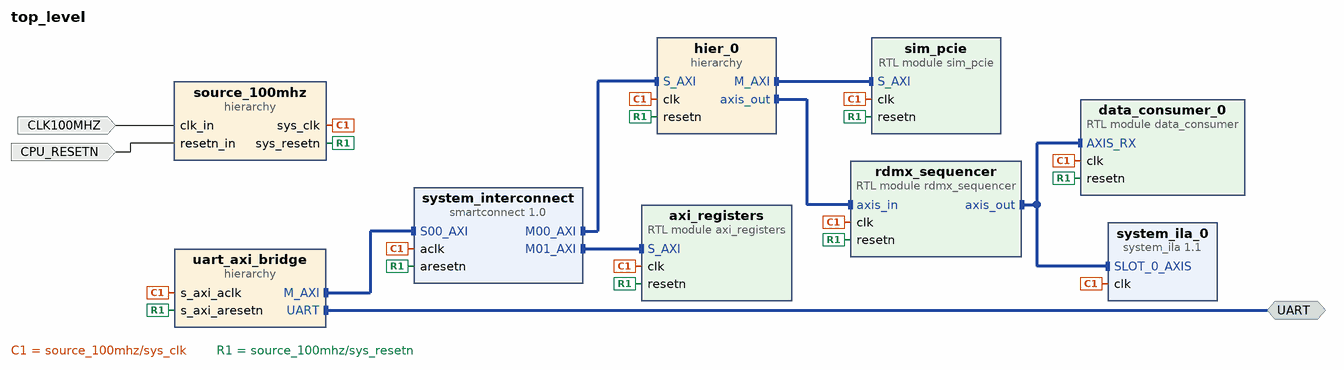
[diagram p0: block diagram of the top level]
# Vivado block design top_level, xc7a100tcsg324-1, Vivado 2024.2
create_bd_design top_level

create_bd_intf_port -mode Master -vlnv xilinx.com:interface:uart_rtl:1.0 UART
create_bd_port -dir I -type clk CLK100MHZ
create_bd_port -dir I -type rst CPU_RESETN

create_bd_cell -type hier source_100mhz
create_bd_cell -type hier uart_axi_bridge
create_bd_cell -type ip -vlnv xilinx.com:ip:smartconnect:1.0 system_interconnect
set_property -dict {CONFIG.NUM_MI 2 CONFIG.NUM_SI 1} [get_bd_cells system_interconnect]
create_bd_cell -type module -reference sim_pcie sim_pcie
set_property -dict {CONFIG.DW 64} [get_bd_cells sim_pcie]
create_bd_cell -type module -reference data_consumer data_consumer_0
set_property -dict {CONFIG.DW 512 CONFIG.NREADY_CYCLES 0 CONFIG.READY_CYCLES 0} [get_bd_cells data_consumer_0]
create_bd_cell -type module -reference rdmx_sequencer rdmx_sequencer
create_bd_cell -type hier hier_0
create_bd_cell -type ip -vlnv xilinx.com:ip:system_ila:1.1 system_ila_0
set_property -dict [list \
  CONFIG.C_DATA_DEPTH 2048 \
  CONFIG.C_SLOT_0_INTF_TYPE xilinx.com:interface:axis_rtl:1.0 \
] [get_bd_cells system_ila_0]
create_bd_cell -type module -reference axi_registers axi_registers

# ---- hierarchy /source_100mhz ----
current_bd_instance /source_100mhz
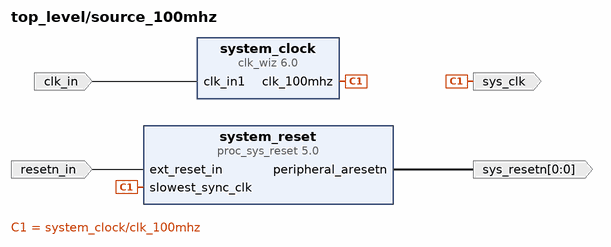
[diagram p1: block diagram inside /source_100mhz]
create_bd_pin -dir I -type clk clk_in
create_bd_pin -dir I -type rst resetn_in
create_bd_pin -dir O -type clk sys_clk
create_bd_pin -dir O -from 0 -to 0 sys_resetn

create_bd_cell -type ip -vlnv xilinx.com:ip:clk_wiz:6.0 system_clock
set_property -dict [list \
  CONFIG.CLKOUT1_JITTER 151.636 \
  CONFIG.CLKOUT1_REQUESTED_OUT_FREQ 50 \
  CONFIG.CLK_OUT1_PORT clk_100mhz \
  CONFIG.MMCM_CLKOUT0_DIVIDE_F 20.000 \
  CONFIG.USE_LOCKED false \
  CONFIG.USE_RESET false \
] [get_bd_cells system_clock]
create_bd_cell -type ip -vlnv xilinx.com:ip:proc_sys_reset:5.0 system_reset

# ---- hierarchy /uart_axi_bridge ----
current_bd_instance /uart_axi_bridge
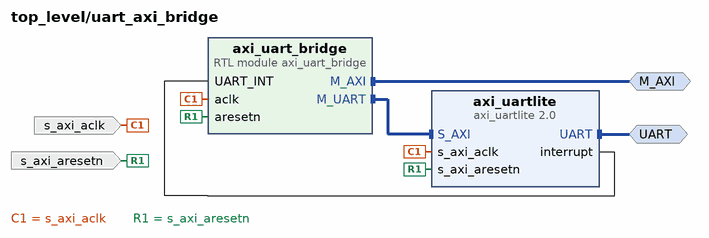
[diagram p2: block diagram inside /uart_axi_bridge]
create_bd_intf_pin -mode Master -vlnv xilinx.com:interface:uart_rtl:1.0 UART
create_bd_intf_pin -mode Master -vlnv xilinx.com:interface:aximm_rtl:1.0 M_AXI
create_bd_pin -dir I -type clk s_axi_aclk
create_bd_pin -dir I -type rst s_axi_aresetn

create_bd_cell -type module -reference axi_uart_bridge axi_uart_bridge
create_bd_cell -type ip -vlnv xilinx.com:ip:axi_uartlite:2.0 axi_uartlite
set_property -dict {CONFIG.C_BAUDRATE 115200} [get_bd_cells axi_uartlite]

# ---- hierarchy /hier_0 ----
current_bd_instance /hier_0
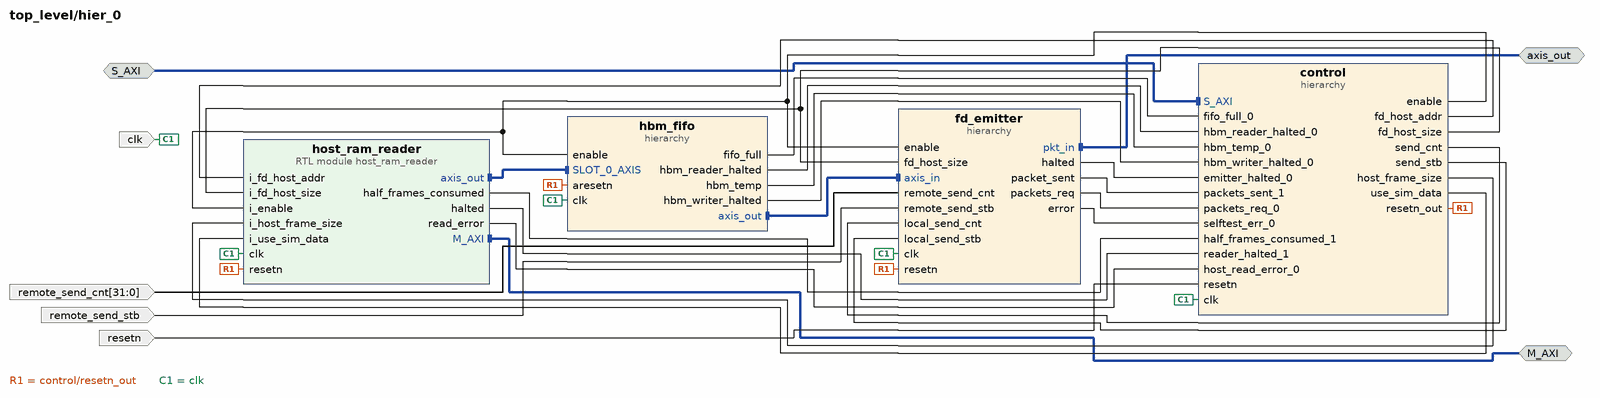
[diagram p3: block diagram inside /hier_0]
create_bd_intf_pin -mode Master -vlnv xilinx.com:interface:aximm_rtl:1.0 M_AXI
create_bd_intf_pin -mode Master -vlnv xilinx.com:interface:axis_rtl:1.0 axis_out
create_bd_intf_pin -mode Slave -vlnv xilinx.com:interface:aximm_rtl:1.0 S_AXI
create_bd_pin -dir I -type clk clk
create_bd_pin -dir I -type rst resetn
create_bd_pin -dir I remote_send_stb
create_bd_pin -dir I -from 31 -to 0 remote_send_cnt

create_bd_cell -type module -reference host_ram_reader host_ram_reader
set_property -dict {CONFIG.DW 64} [get_bd_cells host_ram_reader]
create_bd_cell -type hier control
create_bd_cell -type hier hbm_fifo
create_bd_cell -type hier fd_emitter

# ---- hierarchy /hier_0/control ----
current_bd_instance /hier_0/control
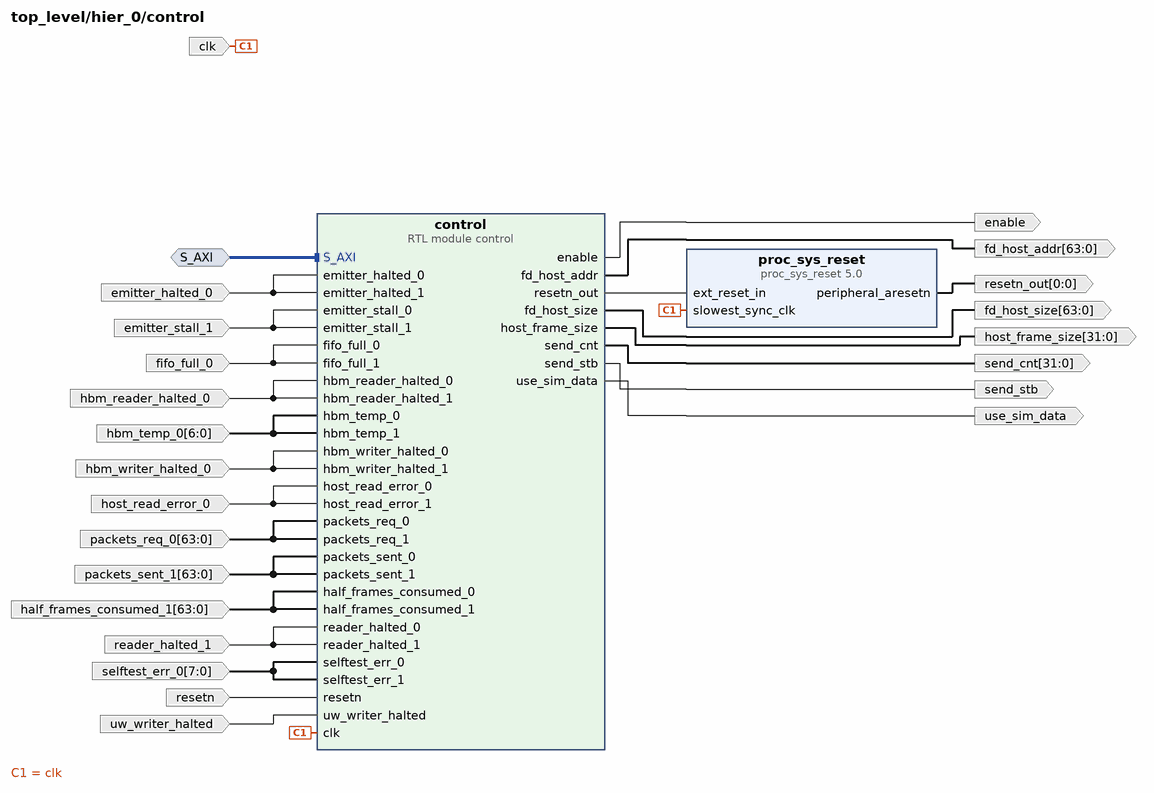
[diagram p4: block diagram inside /hier_0/control]
create_bd_intf_pin -mode Slave -vlnv xilinx.com:interface:aximm_rtl:1.0 S_AXI
create_bd_pin -dir I -type clk clk
create_bd_pin -dir I -type rst resetn
create_bd_pin -dir O enable
create_bd_pin -dir O -from 31 -to 0 host_frame_size
create_bd_pin -dir O -from 63 -to 0 fd_host_addr
create_bd_pin -dir O -from 63 -to 0 fd_host_size
create_bd_pin -dir I -from 63 -to 0 half_frames_consumed_1
create_bd_pin -dir I reader_halted_1
create_bd_pin -dir O send_stb
create_bd_pin -dir O -from 31 -to 0 send_cnt
create_bd_pin -dir O use_sim_data
create_bd_pin -dir O -from 0 -to 0 -type rst resetn_out
create_bd_pin -dir I -from 6 -to 0 hbm_temp_0
create_bd_pin -dir I -from 7 -to 0 selftest_err_0
create_bd_pin -dir I fifo_full_0
create_bd_pin -dir I emitter_halted_0
create_bd_pin -dir I -from 63 -to 0 packets_req_0
create_bd_pin -dir I -from 63 -to 0 packets_sent_1
create_bd_pin -dir I host_read_error_0
create_bd_pin -dir I uw_writer_halted
create_bd_pin -dir I hbm_writer_halted_0
create_bd_pin -dir I hbm_reader_halted_0
create_bd_pin -dir I emitter_stall_1

create_bd_cell -type module -reference control control
create_bd_cell -type ip -vlnv xilinx.com:ip:proc_sys_reset:5.0 proc_sys_reset

# ---- hierarchy /hier_0/hbm_fifo ----
current_bd_instance /hier_0/hbm_fifo
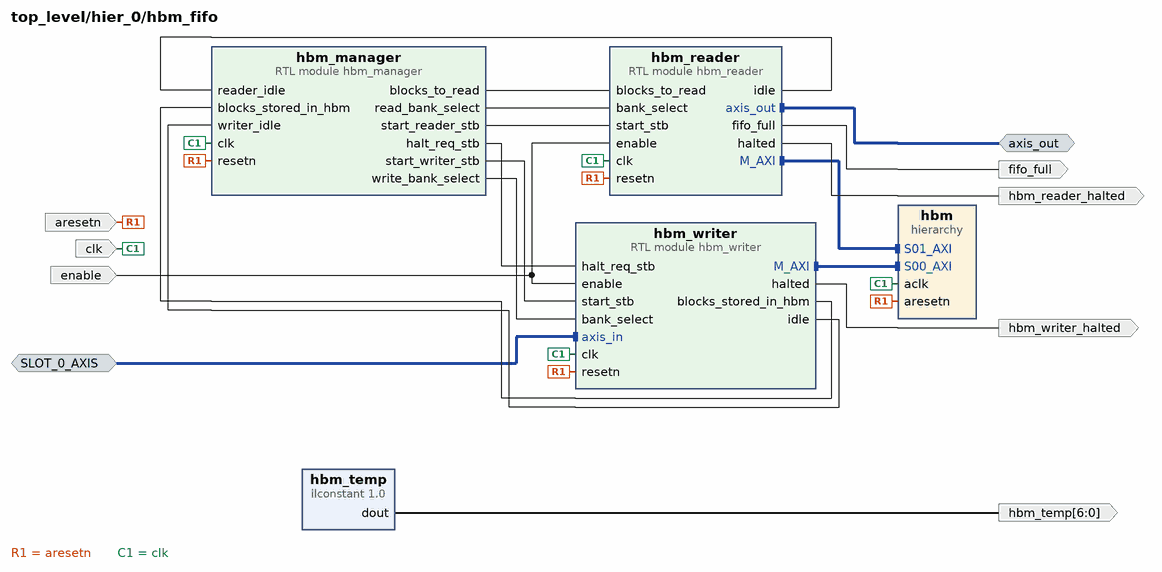
[diagram p5: block diagram inside /hier_0/hbm_fifo]
create_bd_intf_pin -mode Slave -vlnv xilinx.com:interface:axis_rtl:1.0 SLOT_0_AXIS
create_bd_intf_pin -mode Master -vlnv xilinx.com:interface:axis_rtl:1.0 axis_out
create_bd_pin -dir I -type clk clk
create_bd_pin -dir I aresetn
create_bd_pin -dir O -from 6 -to 0 hbm_temp
create_bd_pin -dir O fifo_full
create_bd_pin -dir I enable
create_bd_pin -dir O hbm_writer_halted
create_bd_pin -dir O hbm_reader_halted

create_bd_cell -type module -reference hbm_writer hbm_writer
set_property -dict {CONFIG.DW 64} [get_bd_cells hbm_writer]
create_bd_cell -type hier hbm
create_bd_cell -type module -reference hbm_manager hbm_manager
create_bd_cell -type module -reference hbm_reader hbm_reader
set_property -dict {CONFIG.DW 64} [get_bd_cells hbm_reader]
create_bd_cell -type inline_hdl -vlnv xilinx.com:inline_hdl:ilconstant:1.0 hbm_temp
set_property -dict {CONFIG.CONST_VAL 125 CONFIG.CONST_WIDTH 7} [get_bd_cells hbm_temp]

# ---- hierarchy /hier_0/hbm_fifo/hbm ----
current_bd_instance /hier_0/hbm_fifo/hbm
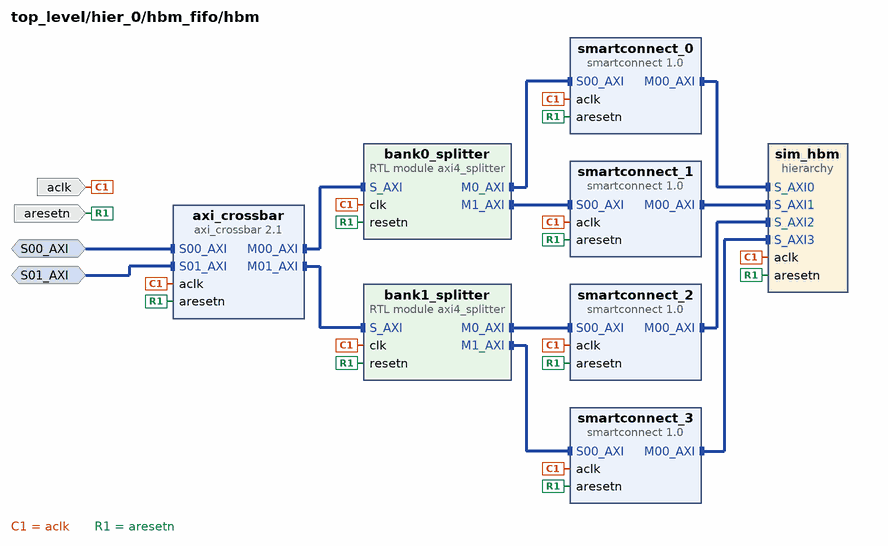
[diagram p6: block diagram inside /hier_0/hbm_fifo/hbm]
create_bd_intf_pin -mode Slave -vlnv xilinx.com:interface:aximm_rtl:1.0 S00_AXI
create_bd_intf_pin -mode Slave -vlnv xilinx.com:interface:aximm_rtl:1.0 S01_AXI
create_bd_pin -dir I aclk
create_bd_pin -dir I aresetn

create_bd_cell -type ip -vlnv xilinx.com:ip:smartconnect:1.0 smartconnect_0
set_property -dict {CONFIG.NUM_MI 1 CONFIG.NUM_SI 1} [get_bd_cells smartconnect_0]
create_bd_cell -type ip -vlnv xilinx.com:ip:smartconnect:1.0 smartconnect_1
set_property -dict {CONFIG.NUM_MI 1 CONFIG.NUM_SI 1} [get_bd_cells smartconnect_1]
create_bd_cell -type ip -vlnv xilinx.com:ip:smartconnect:1.0 smartconnect_2
set_property -dict {CONFIG.NUM_MI 1 CONFIG.NUM_SI 1} [get_bd_cells smartconnect_2]
create_bd_cell -type ip -vlnv xilinx.com:ip:smartconnect:1.0 smartconnect_3
set_property -dict {CONFIG.NUM_MI 1 CONFIG.NUM_SI 1} [get_bd_cells smartconnect_3]
create_bd_cell -type module -reference axi4_splitter bank0_splitter
set_property -dict {CONFIG.BASE_ADDR1 0x0000000000001000 CONFIG.DW 64} [get_bd_cells bank0_splitter]
create_bd_cell -type module -reference axi4_splitter bank1_splitter
set_property -dict [list \
  CONFIG.ADDR_OFFSET 0x0000000000002000 \
  CONFIG.BASE_ADDR0 0x0000000000002000 \
  CONFIG.BASE_ADDR1 0x0000000000003000 \
  CONFIG.DW 64 \
] [get_bd_cells bank1_splitter]
create_bd_cell -type ip -vlnv xilinx.com:ip:axi_crossbar:2.1 axi_crossbar
set_property -dict {CONFIG.NUM_MI 2 CONFIG.NUM_SI 2 CONFIG.STRATEGY 2} [get_bd_cells axi_crossbar]
create_bd_cell -type hier sim_hbm

# ---- hierarchy /hier_0/hbm_fifo/hbm/sim_hbm ----
current_bd_instance /hier_0/hbm_fifo/hbm/sim_hbm
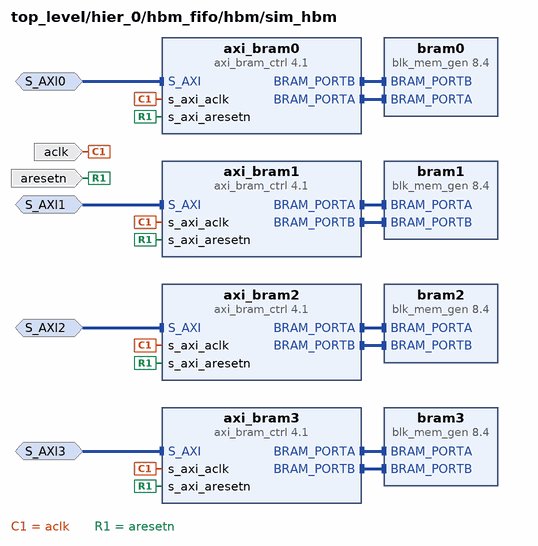
[diagram p7: block diagram inside /hier_0/hbm_fifo/hbm/sim_hbm]
create_bd_intf_pin -mode Slave -vlnv xilinx.com:interface:aximm_rtl:1.0 S_AXI0
create_bd_intf_pin -mode Slave -vlnv xilinx.com:interface:aximm_rtl:1.0 S_AXI1
create_bd_intf_pin -mode Slave -vlnv xilinx.com:interface:aximm_rtl:1.0 S_AXI2
create_bd_intf_pin -mode Slave -vlnv xilinx.com:interface:aximm_rtl:1.0 S_AXI3
create_bd_pin -dir I aclk
create_bd_pin -dir I aresetn

create_bd_cell -type ip -vlnv xilinx.com:ip:blk_mem_gen:8.4 bram3
set_property -dict {CONFIG.Memory_Type True_Dual_Port_RAM} [get_bd_cells bram3]
create_bd_cell -type ip -vlnv xilinx.com:ip:axi_bram_ctrl:4.1 axi_bram0
set_property -dict {CONFIG.DATA_WIDTH 32 CONFIG.SINGLE_PORT_BRAM 0} [get_bd_cells axi_bram0]
create_bd_cell -type ip -vlnv xilinx.com:ip:axi_bram_ctrl:4.1 axi_bram1
set_property -dict {CONFIG.DATA_WIDTH 32 CONFIG.SINGLE_PORT_BRAM 0} [get_bd_cells axi_bram1]
create_bd_cell -type ip -vlnv xilinx.com:ip:axi_bram_ctrl:4.1 axi_bram2
set_property -dict {CONFIG.DATA_WIDTH 32 CONFIG.SINGLE_PORT_BRAM 0} [get_bd_cells axi_bram2]
create_bd_cell -type ip -vlnv xilinx.com:ip:axi_bram_ctrl:4.1 axi_bram3
set_property -dict {CONFIG.DATA_WIDTH 32 CONFIG.SINGLE_PORT_BRAM 0} [get_bd_cells axi_bram3]
create_bd_cell -type ip -vlnv xilinx.com:ip:blk_mem_gen:8.4 bram1
set_property -dict {CONFIG.Memory_Type True_Dual_Port_RAM} [get_bd_cells bram1]
create_bd_cell -type ip -vlnv xilinx.com:ip:blk_mem_gen:8.4 bram2
set_property -dict {CONFIG.Memory_Type True_Dual_Port_RAM} [get_bd_cells bram2]
create_bd_cell -type ip -vlnv xilinx.com:ip:blk_mem_gen:8.4 bram0
set_property -dict {CONFIG.Memory_Type True_Dual_Port_RAM} [get_bd_cells bram0]

# ---- hierarchy /hier_0/fd_emitter ----
current_bd_instance /hier_0/fd_emitter
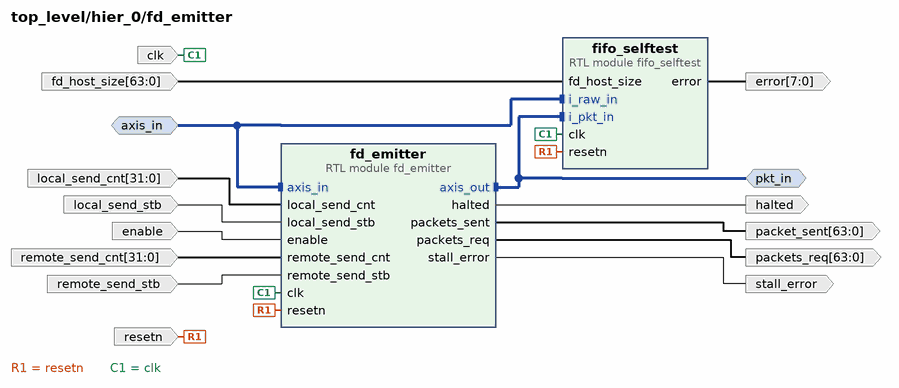
[diagram p8: block diagram inside /hier_0/fd_emitter]
create_bd_intf_pin -mode Slave -vlnv xilinx.com:interface:axis_rtl:1.0 axis_in
create_bd_intf_pin -mode Master -vlnv xilinx.com:interface:axis_rtl:1.0 pkt_in
create_bd_pin -dir I -type clk clk
create_bd_pin -dir I -type rst resetn
create_bd_pin -dir I local_send_stb
create_bd_pin -dir I remote_send_stb
create_bd_pin -dir I -from 31 -to 0 local_send_cnt
create_bd_pin -dir I -from 31 -to 0 remote_send_cnt
create_bd_pin -dir I -from 63 -to 0 fd_host_size
create_bd_pin -dir O -from 7 -to 0 error
create_bd_pin -dir I enable
create_bd_pin -dir O halted
create_bd_pin -dir O -from 63 -to 0 packets_req
create_bd_pin -dir O -from 63 -to 0 packet_sent
create_bd_pin -dir O stall_error

create_bd_cell -type module -reference fd_emitter fd_emitter
set_property -dict {CONFIG.IN_DW 64} [get_bd_cells fd_emitter]
create_bd_cell -type module -reference fifo_selftest fifo_selftest
set_property -dict {CONFIG.DW 64} [get_bd_cells fifo_selftest]

# ---- connections ----

current_bd_instance /source_100mhz
connect_bd_net -net clk_in1_0_1 [get_bd_pins clk_in] [get_bd_pins system_clock/clk_in1]
connect_bd_net -net ext_reset_in_0_1 [get_bd_pins resetn_in] [get_bd_pins system_reset/ext_reset_in]
connect_bd_net [get_bd_pins system_clock/clk_100mhz] [get_bd_pins sys_clk] [get_bd_pins system_reset/slowest_sync_clk]
connect_bd_net [get_bd_pins system_reset/peripheral_aresetn] [get_bd_pins sys_resetn]

current_bd_instance /uart_axi_bridge
connect_bd_intf_net [get_bd_intf_pins M_AXI] [get_bd_intf_pins axi_uart_bridge/M_AXI]
connect_bd_intf_net [get_bd_intf_pins axi_uart_bridge/M_UART] [get_bd_intf_pins axi_uartlite/S_AXI]
connect_bd_intf_net [get_bd_intf_pins UART] [get_bd_intf_pins axi_uartlite/UART]
connect_bd_net [get_bd_pins axi_uartlite/interrupt] [get_bd_pins axi_uart_bridge/UART_INT]
connect_bd_net -net source_100mhz_sys_clk [get_bd_pins s_axi_aclk] [get_bd_pins axi_uart_bridge/aclk] [get_bd_pins axi_uartlite/s_axi_aclk]
connect_bd_net -net source_100mhz_sys_resetn [get_bd_pins s_axi_aresetn] \
  [get_bd_pins axi_uart_bridge/aresetn] [get_bd_pins axi_uartlite/s_axi_aresetn]

current_bd_instance /hier_0
connect_bd_intf_net [get_bd_intf_pins axis_out] [get_bd_intf_pins fd_emitter/pkt_in]
connect_bd_intf_net [get_bd_intf_pins hbm_fifo/axis_out] [get_bd_intf_pins fd_emitter/axis_in]
connect_bd_intf_net [get_bd_intf_pins M_AXI] [get_bd_intf_pins host_ram_reader/M_AXI]
connect_bd_intf_net [get_bd_intf_pins hbm_fifo/SLOT_0_AXIS] [get_bd_intf_pins host_ram_reader/axis_out]
connect_bd_intf_net [get_bd_intf_pins S_AXI] [get_bd_intf_pins control/S_AXI]
connect_bd_net [get_bd_pins control/enable] [get_bd_pins fd_emitter/enable] [get_bd_pins host_ram_reader/i_enable] [get_bd_pins hbm_fifo/enable]
connect_bd_net [get_bd_pins control/fd_host_addr] [get_bd_pins host_ram_reader/i_fd_host_addr]
connect_bd_net [get_bd_pins control/fd_host_size] [get_bd_pins fd_emitter/fd_host_size] [get_bd_pins host_ram_reader/i_fd_host_size]
connect_bd_net [get_bd_pins control/host_frame_size] [get_bd_pins host_ram_reader/i_host_frame_size]
connect_bd_net [get_bd_pins control/resetn_out] [get_bd_pins hbm_fifo/aresetn] [get_bd_pins fd_emitter/resetn] [get_bd_pins host_ram_reader/resetn]
connect_bd_net [get_bd_pins control/send_cnt] [get_bd_pins fd_emitter/local_send_cnt]
connect_bd_net [get_bd_pins control/send_stb] [get_bd_pins fd_emitter/local_send_stb]
connect_bd_net [get_bd_pins control/use_sim_data] [get_bd_pins host_ram_reader/i_use_sim_data]
connect_bd_net [get_bd_pins fd_emitter/halted] [get_bd_pins control/emitter_halted_0]
connect_bd_net [get_bd_pins fd_emitter/packet_sent] [get_bd_pins control/packets_sent_1]
connect_bd_net [get_bd_pins fd_emitter/packets_req] [get_bd_pins control/packets_req_0]
connect_bd_net -net fifo_selftest_0_error [get_bd_pins fd_emitter/error] [get_bd_pins control/selftest_err_0]
connect_bd_net [get_bd_pins hbm_fifo/fifo_full] [get_bd_pins control/fifo_full_0]
connect_bd_net [get_bd_pins hbm_fifo/hbm_reader_halted] [get_bd_pins control/hbm_reader_halted_0]
connect_bd_net [get_bd_pins hbm_fifo/hbm_temp] [get_bd_pins control/hbm_temp_0]
connect_bd_net [get_bd_pins hbm_fifo/hbm_writer_halted] [get_bd_pins control/hbm_writer_halted_0]
connect_bd_net [get_bd_pins host_ram_reader/half_frames_consumed] [get_bd_pins control/half_frames_consumed_1]
connect_bd_net [get_bd_pins host_ram_reader/halted] [get_bd_pins control/reader_halted_1]
connect_bd_net [get_bd_pins host_ram_reader/read_error] [get_bd_pins control/host_read_error_0]
connect_bd_net [get_bd_pins remote_send_cnt] [get_bd_pins fd_emitter/remote_send_cnt]
connect_bd_net [get_bd_pins remote_send_stb] [get_bd_pins fd_emitter/remote_send_stb]
connect_bd_net -net source_100mhz_sys_clk [get_bd_pins clk] \
  [get_bd_pins control/clk] [get_bd_pins hbm_fifo/clk] [get_bd_pins fd_emitter/clk] [get_bd_pins host_ram_reader/clk]
connect_bd_net -net source_100mhz_sys_resetn [get_bd_pins resetn] [get_bd_pins control/resetn]

current_bd_instance /hier_0/control
connect_bd_intf_net [get_bd_intf_pins S_AXI] [get_bd_intf_pins control/S_AXI]
connect_bd_net [get_bd_pins control/enable] [get_bd_pins enable]
connect_bd_net [get_bd_pins control/fd_host_addr] [get_bd_pins fd_host_addr]
connect_bd_net [get_bd_pins control/fd_host_size] [get_bd_pins fd_host_size]
connect_bd_net [get_bd_pins control/host_frame_size] [get_bd_pins host_frame_size]
connect_bd_net [get_bd_pins control/resetn_out] [get_bd_pins proc_sys_reset/ext_reset_in]
connect_bd_net [get_bd_pins control/send_cnt] [get_bd_pins send_cnt]
connect_bd_net [get_bd_pins control/send_stb] [get_bd_pins send_stb]
connect_bd_net [get_bd_pins control/use_sim_data] [get_bd_pins use_sim_data]
connect_bd_net -net emitter_halted_0_1 [get_bd_pins emitter_halted_0] [get_bd_pins control/emitter_halted_0] [get_bd_pins control/emitter_halted_1]
connect_bd_net -net emitter_stall_1_1 [get_bd_pins emitter_stall_1] [get_bd_pins control/emitter_stall_1] [get_bd_pins control/emitter_stall_0]
connect_bd_net -net fifo_full_0_1 [get_bd_pins fifo_full_0] [get_bd_pins control/fifo_full_0] [get_bd_pins control/fifo_full_1]
connect_bd_net -net hbm_reader_halted_0_1 [get_bd_pins hbm_reader_halted_0] \
  [get_bd_pins control/hbm_reader_halted_0] [get_bd_pins control/hbm_reader_halted_1]
connect_bd_net -net hbm_temp_0_1 [get_bd_pins hbm_temp_0] [get_bd_pins control/hbm_temp_0] [get_bd_pins control/hbm_temp_1]
connect_bd_net -net hbm_writer_halted_0_1 [get_bd_pins hbm_writer_halted_0] \
  [get_bd_pins control/hbm_writer_halted_0] [get_bd_pins control/hbm_writer_halted_1]
connect_bd_net -net host_read_error_0_1 [get_bd_pins host_read_error_0] \
  [get_bd_pins control/host_read_error_0] [get_bd_pins control/host_read_error_1]
connect_bd_net -net packets_req_0_1 [get_bd_pins packets_req_0] [get_bd_pins control/packets_req_0] [get_bd_pins control/packets_req_1]
connect_bd_net -net packets_sent_1_1 [get_bd_pins packets_sent_1] [get_bd_pins control/packets_sent_0] [get_bd_pins control/packets_sent_1]
connect_bd_net [get_bd_pins proc_sys_reset/peripheral_aresetn] [get_bd_pins resetn_out]
connect_bd_net -net ram_reader_half_frames_consumed [get_bd_pins half_frames_consumed_1] \
  [get_bd_pins control/half_frames_consumed_0] [get_bd_pins control/half_frames_consumed_1]
connect_bd_net -net ram_reader_halted [get_bd_pins reader_halted_1] [get_bd_pins control/reader_halted_0] [get_bd_pins control/reader_halted_1]
connect_bd_net -net selftest_err_0_1 [get_bd_pins selftest_err_0] [get_bd_pins control/selftest_err_0] [get_bd_pins control/selftest_err_1]
connect_bd_net -net source_100mhz_sys_clk [get_bd_pins clk] [get_bd_pins proc_sys_reset/slowest_sync_clk] [get_bd_pins control/clk]
connect_bd_net -net source_100mhz_sys_resetn [get_bd_pins resetn] [get_bd_pins control/resetn]
connect_bd_net [get_bd_pins uw_writer_halted] [get_bd_pins control/uw_writer_halted]

current_bd_instance /hier_0/hbm_fifo
connect_bd_intf_net [get_bd_intf_pins hbm_reader/M_AXI] [get_bd_intf_pins hbm/S01_AXI]
connect_bd_intf_net [get_bd_intf_pins axis_out] [get_bd_intf_pins hbm_reader/axis_out]
connect_bd_intf_net [get_bd_intf_pins hbm/S00_AXI] [get_bd_intf_pins hbm_writer/M_AXI]
connect_bd_intf_net [get_bd_intf_pins SLOT_0_AXIS] [get_bd_intf_pins hbm_writer/axis_in]
connect_bd_net -net control_resetn_out [get_bd_pins aresetn] \
  [get_bd_pins hbm/aresetn] [get_bd_pins hbm_manager/resetn] [get_bd_pins hbm_writer/resetn] [get_bd_pins hbm_reader/resetn]
connect_bd_net [get_bd_pins enable] [get_bd_pins hbm_reader/enable] [get_bd_pins hbm_writer/enable]
connect_bd_net -net hbm_manager_0_halt_req_stb [get_bd_pins hbm_manager/halt_req_stb] [get_bd_pins hbm_writer/halt_req_stb]
connect_bd_net -net hbm_manager_0_start_writer_stb [get_bd_pins hbm_manager/start_writer_stb] [get_bd_pins hbm_writer/start_stb]
connect_bd_net -net hbm_manager_0_write_bank_select [get_bd_pins hbm_manager/write_bank_select] [get_bd_pins hbm_writer/bank_select]
connect_bd_net [get_bd_pins hbm_manager/blocks_to_read] [get_bd_pins hbm_reader/blocks_to_read]
connect_bd_net [get_bd_pins hbm_manager/read_bank_select] [get_bd_pins hbm_reader/bank_select]
connect_bd_net [get_bd_pins hbm_manager/start_reader_stb] [get_bd_pins hbm_reader/start_stb]
connect_bd_net -net hbm_reader_0_idle [get_bd_pins hbm_reader/idle] [get_bd_pins hbm_manager/reader_idle]
connect_bd_net [get_bd_pins hbm_reader/fifo_full] [get_bd_pins fifo_full]
connect_bd_net [get_bd_pins hbm_reader/halted] [get_bd_pins hbm_reader_halted]
connect_bd_net -net hbm_writer_0_blocks_stored_in_hbm [get_bd_pins hbm_writer/blocks_stored_in_hbm] [get_bd_pins hbm_manager/blocks_stored_in_hbm]
connect_bd_net -net hbm_writer_0_idle [get_bd_pins hbm_writer/idle] [get_bd_pins hbm_manager/writer_idle]
connect_bd_net [get_bd_pins hbm_writer/halted] [get_bd_pins hbm_writer_halted]
connect_bd_net -net ilconstant_0_dout [get_bd_pins hbm_temp/dout] [get_bd_pins hbm_temp]
connect_bd_net -net source_100mhz_sys_clk [get_bd_pins clk] \
  [get_bd_pins hbm/aclk] [get_bd_pins hbm_manager/clk] [get_bd_pins hbm_writer/clk] [get_bd_pins hbm_reader/clk]

current_bd_instance /hier_0/hbm_fifo/hbm
connect_bd_intf_net [get_bd_intf_pins S00_AXI] [get_bd_intf_pins axi_crossbar/S00_AXI]
connect_bd_intf_net [get_bd_intf_pins S01_AXI] [get_bd_intf_pins axi_crossbar/S01_AXI]
connect_bd_intf_net [get_bd_intf_pins axi_crossbar/M00_AXI] [get_bd_intf_pins bank0_splitter/S_AXI]
connect_bd_intf_net [get_bd_intf_pins axi_crossbar/M01_AXI] [get_bd_intf_pins bank1_splitter/S_AXI]
connect_bd_intf_net [get_bd_intf_pins bank0_splitter/M0_AXI] [get_bd_intf_pins smartconnect_0/S00_AXI]
connect_bd_intf_net [get_bd_intf_pins bank0_splitter/M1_AXI] [get_bd_intf_pins smartconnect_1/S00_AXI]
connect_bd_intf_net [get_bd_intf_pins bank1_splitter/M0_AXI] [get_bd_intf_pins smartconnect_2/S00_AXI]
connect_bd_intf_net [get_bd_intf_pins bank1_splitter/M1_AXI] [get_bd_intf_pins smartconnect_3/S00_AXI]
connect_bd_intf_net [get_bd_intf_pins smartconnect_0/M00_AXI] [get_bd_intf_pins sim_hbm/S_AXI0]
connect_bd_intf_net [get_bd_intf_pins smartconnect_1/M00_AXI] [get_bd_intf_pins sim_hbm/S_AXI1]
connect_bd_intf_net [get_bd_intf_pins smartconnect_2/M00_AXI] [get_bd_intf_pins sim_hbm/S_AXI2]
connect_bd_intf_net [get_bd_intf_pins smartconnect_3/M00_AXI] [get_bd_intf_pins sim_hbm/S_AXI3]
connect_bd_net [get_bd_pins aclk] \
  [get_bd_pins smartconnect_0/aclk] [get_bd_pins smartconnect_1/aclk] [get_bd_pins smartconnect_2/aclk] \
  [get_bd_pins smartconnect_3/aclk] [get_bd_pins bank0_splitter/clk] [get_bd_pins bank1_splitter/clk] \
  [get_bd_pins axi_crossbar/aclk] [get_bd_pins sim_hbm/aclk]
connect_bd_net [get_bd_pins aresetn] \
  [get_bd_pins smartconnect_0/aresetn] [get_bd_pins smartconnect_1/aresetn] [get_bd_pins smartconnect_2/aresetn] \
  [get_bd_pins bank0_splitter/resetn] [get_bd_pins bank1_splitter/resetn] [get_bd_pins smartconnect_3/aresetn] \
  [get_bd_pins axi_crossbar/aresetn] [get_bd_pins sim_hbm/aresetn]

current_bd_instance /hier_0/hbm_fifo/hbm/sim_hbm
connect_bd_intf_net [get_bd_intf_pins axi_bram0/BRAM_PORTB] [get_bd_intf_pins bram0/BRAM_PORTB]
connect_bd_intf_net [get_bd_intf_pins axi_bram1/BRAM_PORTA] [get_bd_intf_pins bram1/BRAM_PORTA]
connect_bd_intf_net [get_bd_intf_pins axi_bram1/BRAM_PORTB] [get_bd_intf_pins bram1/BRAM_PORTB]
connect_bd_intf_net [get_bd_intf_pins axi_bram2/BRAM_PORTA] [get_bd_intf_pins bram2/BRAM_PORTA]
connect_bd_intf_net [get_bd_intf_pins axi_bram2/BRAM_PORTB] [get_bd_intf_pins bram2/BRAM_PORTB]
connect_bd_intf_net [get_bd_intf_pins axi_bram3/BRAM_PORTA] [get_bd_intf_pins bram3/BRAM_PORTA]
connect_bd_intf_net [get_bd_intf_pins axi_bram3/BRAM_PORTB] [get_bd_intf_pins bram3/BRAM_PORTB]
connect_bd_intf_net [get_bd_intf_pins axi_bram0/BRAM_PORTA] [get_bd_intf_pins bram0/BRAM_PORTA]
connect_bd_intf_net [get_bd_intf_pins S_AXI0] [get_bd_intf_pins axi_bram0/S_AXI]
connect_bd_intf_net [get_bd_intf_pins S_AXI1] [get_bd_intf_pins axi_bram1/S_AXI]
connect_bd_intf_net [get_bd_intf_pins S_AXI2] [get_bd_intf_pins axi_bram2/S_AXI]
connect_bd_intf_net [get_bd_intf_pins S_AXI3] [get_bd_intf_pins axi_bram3/S_AXI]
connect_bd_net [get_bd_pins aclk] \
  [get_bd_pins axi_bram1/s_axi_aclk] [get_bd_pins axi_bram2/s_axi_aclk] [get_bd_pins axi_bram3/s_axi_aclk] \
  [get_bd_pins axi_bram0/s_axi_aclk]
connect_bd_net [get_bd_pins aresetn] \
  [get_bd_pins axi_bram1/s_axi_aresetn] [get_bd_pins axi_bram2/s_axi_aresetn] [get_bd_pins axi_bram3/s_axi_aresetn] \
  [get_bd_pins axi_bram0/s_axi_aresetn]

current_bd_instance /hier_0/fd_emitter
connect_bd_intf_net [get_bd_intf_pins pkt_in] [get_bd_intf_pins fd_emitter/axis_out]
connect_bd_intf_net [get_bd_intf_pins pkt_in] [get_bd_intf_pins fifo_selftest/i_pkt_in]
connect_bd_intf_net [get_bd_intf_pins axis_in] [get_bd_intf_pins fd_emitter/axis_in]
connect_bd_intf_net [get_bd_intf_pins axis_in] [get_bd_intf_pins fifo_selftest/i_raw_in]
connect_bd_net -net control_fd_host_size [get_bd_pins fd_host_size] [get_bd_pins fifo_selftest/fd_host_size]
connect_bd_net -net control_resetn_out [get_bd_pins resetn] [get_bd_pins fifo_selftest/resetn] [get_bd_pins fd_emitter/resetn]
connect_bd_net -net control_send_cnt [get_bd_pins local_send_cnt] [get_bd_pins fd_emitter/local_send_cnt]
connect_bd_net -net control_send_stb [get_bd_pins local_send_stb] [get_bd_pins fd_emitter/local_send_stb]
connect_bd_net [get_bd_pins enable] [get_bd_pins fd_emitter/enable]
connect_bd_net [get_bd_pins fd_emitter/halted] [get_bd_pins halted]
connect_bd_net -net fd_emitter_packet_sent [get_bd_pins fd_emitter/packets_sent] [get_bd_pins packet_sent]
connect_bd_net [get_bd_pins fd_emitter/packets_req] [get_bd_pins packets_req]
connect_bd_net [get_bd_pins fd_emitter/stall_error] [get_bd_pins stall_error]
connect_bd_net -net fifo_selftest_0_error [get_bd_pins fifo_selftest/error] [get_bd_pins error]
connect_bd_net [get_bd_pins remote_send_cnt] [get_bd_pins fd_emitter/remote_send_cnt]
connect_bd_net [get_bd_pins remote_send_stb] [get_bd_pins fd_emitter/remote_send_stb]
connect_bd_net -net source_100mhz_sys_clk [get_bd_pins clk] [get_bd_pins fifo_selftest/clk] [get_bd_pins fd_emitter/clk]

current_bd_instance /
connect_bd_intf_net [get_bd_intf_ports UART] [get_bd_intf_pins uart_axi_bridge/UART]
connect_bd_intf_net [get_bd_intf_pins rdmx_sequencer/axis_out] [get_bd_intf_pins data_consumer_0/AXIS_RX]
connect_bd_intf_net [get_bd_intf_pins rdmx_sequencer/axis_out] [get_bd_intf_pins system_ila_0/SLOT_0_AXIS]
connect_bd_intf_net [get_bd_intf_pins hier_0/axis_out] [get_bd_intf_pins rdmx_sequencer/axis_in]
connect_bd_intf_net [get_bd_intf_pins hier_0/M_AXI] [get_bd_intf_pins sim_pcie/S_AXI]
connect_bd_intf_net [get_bd_intf_pins hier_0/S_AXI] [get_bd_intf_pins system_interconnect/M00_AXI]
connect_bd_intf_net [get_bd_intf_pins axi_registers/S_AXI] [get_bd_intf_pins system_interconnect/M01_AXI]
connect_bd_intf_net [get_bd_intf_pins uart_axi_bridge/M_AXI] [get_bd_intf_pins system_interconnect/S00_AXI]
connect_bd_net -net clk_in1_0_1 [get_bd_ports CLK100MHZ] [get_bd_pins source_100mhz/clk_in]
connect_bd_net -net ext_reset_in_0_1 [get_bd_ports CPU_RESETN] [get_bd_pins source_100mhz/resetn_in]
connect_bd_net [get_bd_pins source_100mhz/sys_clk] \
  [get_bd_pins uart_axi_bridge/s_axi_aclk] [get_bd_pins system_interconnect/aclk] [get_bd_pins data_consumer_0/clk] \
  [get_bd_pins sim_pcie/clk] [get_bd_pins rdmx_sequencer/clk] [get_bd_pins hier_0/clk] [get_bd_pins system_ila_0/clk] \
  [get_bd_pins axi_registers/clk]
connect_bd_net [get_bd_pins source_100mhz/sys_resetn] \
  [get_bd_pins uart_axi_bridge/s_axi_aresetn] [get_bd_pins system_interconnect/aresetn] [get_bd_pins data_consumer_0/resetn] \
  [get_bd_pins sim_pcie/resetn] [get_bd_pins rdmx_sequencer/resetn] [get_bd_pins hier_0/resetn] \
  [get_bd_pins axi_registers/resetn]

# ---- address map ----
assign_bd_address -offset 0x000000000 -range 4K -target_address_space [get_bd_addr_spaces hier_0/hbm_fifo/hbm/bank0_splitter/M0_AXI] [get_bd_addr_segs hier_0/hbm_fifo/hbm/sim_hbm/axi_bram0/S_AXI/Mem0]
assign_bd_address -offset 0x000001000 -range 4K -target_address_space [get_bd_addr_spaces hier_0/hbm_fifo/hbm/bank0_splitter/M1_AXI] [get_bd_addr_segs hier_0/hbm_fifo/hbm/sim_hbm/axi_bram1/S_AXI/Mem0]
assign_bd_address -offset 0x000002000 -range 4K -target_address_space [get_bd_addr_spaces hier_0/hbm_fifo/hbm/bank1_splitter/M0_AXI] [get_bd_addr_segs hier_0/hbm_fifo/hbm/sim_hbm/axi_bram2/S_AXI/Mem0]
assign_bd_address -offset 0x000003000 -range 4K -target_address_space [get_bd_addr_spaces hier_0/hbm_fifo/hbm/bank1_splitter/M1_AXI] [get_bd_addr_segs hier_0/hbm_fifo/hbm/sim_hbm/axi_bram3/S_AXI/Mem0]
assign_bd_address -offset 0x0000000000000000 -range 8K -target_address_space [get_bd_addr_spaces hier_0/hbm_fifo/hbm_reader/M_AXI] [get_bd_addr_segs hier_0/hbm_fifo/hbm/bank0_splitter/S_AXI/reg0]
assign_bd_address -offset 0x0000000000002000 -range 8K -target_address_space [get_bd_addr_spaces hier_0/hbm_fifo/hbm_reader/M_AXI] [get_bd_addr_segs hier_0/hbm_fifo/hbm/bank1_splitter/S_AXI/reg0]
assign_bd_address -offset 0x0000000000000000 -range 8K -target_address_space [get_bd_addr_spaces hier_0/hbm_fifo/hbm_writer/M_AXI] [get_bd_addr_segs hier_0/hbm_fifo/hbm/bank0_splitter/S_AXI/reg0]
assign_bd_address -offset 0x0000000000002000 -range 8K -target_address_space [get_bd_addr_spaces hier_0/hbm_fifo/hbm_writer/M_AXI] [get_bd_addr_segs hier_0/hbm_fifo/hbm/bank1_splitter/S_AXI/reg0]
assign_bd_address -offset 0x0000000000000000 -range 16E -target_address_space [get_bd_addr_spaces hier_0/host_ram_reader/M_AXI] [get_bd_addr_segs sim_pcie/S_AXI/reg0]
assign_bd_address -offset 0x0000000000001000 -range 4K -target_address_space [get_bd_addr_spaces uart_axi_bridge/axi_uart_bridge/M_AXI] [get_bd_addr_segs hier_0/control/control/S_AXI/reg0]
assign_bd_address -offset 0x0000000000002000 -range 4K -target_address_space [get_bd_addr_spaces uart_axi_bridge/axi_uart_bridge/M_AXI] [get_bd_addr_segs axi_registers/S_AXI/reg0]
assign_bd_address -offset 0x40600000 -range 64K -target_address_space [get_bd_addr_spaces uart_axi_bridge/axi_uart_bridge/M_UART] [get_bd_addr_segs uart_axi_bridge/axi_uartlite/S_AXI/Reg]

validate_bd_design
save_bd_design
